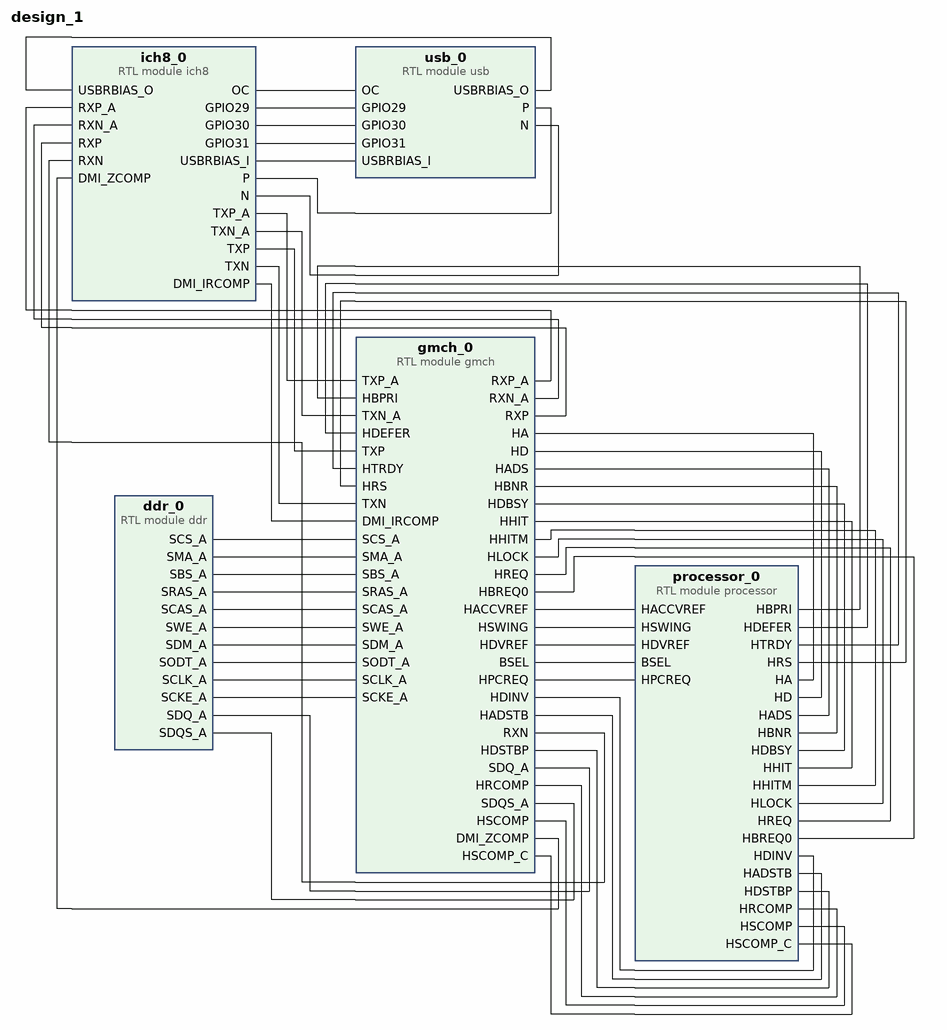
[diagram p0: block diagram of the top level]
# Vivado block design design_1, xc7a100tcsg324-1, Vivado 2019.2
create_bd_design design_1

create_bd_cell -type module -reference usb usb_0
create_bd_cell -type module -reference ich8 ich8_0
create_bd_cell -type module -reference ddr ddr_0
create_bd_cell -type module -reference gmch gmch_0
create_bd_cell -type module -reference processor processor_0

# ---- connections ----

connect_bd_net [get_bd_pins processor_0/HA] [get_bd_pins gmch_0/HA]
connect_bd_net [get_bd_pins gmch_0/HD] [get_bd_pins processor_0/HD]
connect_bd_net [get_bd_pins gmch_0/HADS] [get_bd_pins processor_0/HADS]
connect_bd_net [get_bd_pins gmch_0/HBNR] [get_bd_pins processor_0/HBNR]
connect_bd_net [get_bd_pins gmch_0/HDBSY] [get_bd_pins processor_0/HDBSY]
connect_bd_net [get_bd_pins gmch_0/HHIT] [get_bd_pins processor_0/HHIT]
connect_bd_net [get_bd_pins processor_0/HBPRI] [get_bd_pins gmch_0/HBPRI]
connect_bd_net [get_bd_pins processor_0/HDEFER] [get_bd_pins gmch_0/HDEFER]
connect_bd_net [get_bd_pins gmch_0/HHITM] [get_bd_pins processor_0/HHITM]
connect_bd_net [get_bd_pins gmch_0/HLOCK] [get_bd_pins processor_0/HLOCK]
connect_bd_net [get_bd_pins gmch_0/HREQ] [get_bd_pins processor_0/HREQ]
connect_bd_net [get_bd_pins processor_0/HTRDY] [get_bd_pins gmch_0/HTRDY]
connect_bd_net [get_bd_pins processor_0/HRS] [get_bd_pins gmch_0/HRS]
connect_bd_net [get_bd_pins gmch_0/HBREQ0] [get_bd_pins processor_0/HBREQ0]
connect_bd_net [get_bd_pins gmch_0/HDINV] [get_bd_pins processor_0/HDINV]
connect_bd_net [get_bd_pins gmch_0/HADSTB] [get_bd_pins processor_0/HADSTB]
connect_bd_net [get_bd_pins gmch_0/HDSTBP] [get_bd_pins processor_0/HDSTBP]
connect_bd_net [get_bd_pins gmch_0/HRCOMP] [get_bd_pins processor_0/HRCOMP]
connect_bd_net [get_bd_pins gmch_0/HSCOMP] [get_bd_pins processor_0/HSCOMP]
connect_bd_net [get_bd_pins gmch_0/HSCOMP_C] [get_bd_pins processor_0/HSCOMP_C]
connect_bd_net [get_bd_pins gmch_0/HACCVREF] [get_bd_pins processor_0/HACCVREF]
connect_bd_net [get_bd_pins gmch_0/HSWING] [get_bd_pins processor_0/HSWING]
connect_bd_net [get_bd_pins gmch_0/HDVREF] [get_bd_pins processor_0/HDVREF]
connect_bd_net [get_bd_pins gmch_0/BSEL] [get_bd_pins processor_0/BSEL]
connect_bd_net [get_bd_pins gmch_0/HPCREQ] [get_bd_pins processor_0/HPCREQ]
connect_bd_net [get_bd_pins ich8_0/TXP_A] [get_bd_pins gmch_0/TXP_A]
connect_bd_net [get_bd_pins ich8_0/TXN_A] [get_bd_pins gmch_0/TXN_A]
connect_bd_net [get_bd_pins ich8_0/TXP] [get_bd_pins gmch_0/TXP]
connect_bd_net [get_bd_pins ich8_0/TXN] [get_bd_pins gmch_0/TXN]
connect_bd_net [get_bd_pins ich8_0/DMI_IRCOMP] [get_bd_pins gmch_0/DMI_IRCOMP]
connect_bd_net [get_bd_pins ich8_0/OC] [get_bd_pins usb_0/OC]
connect_bd_net [get_bd_pins ich8_0/GPIO29] [get_bd_pins usb_0/GPIO29]
connect_bd_net [get_bd_pins ich8_0/GPIO30] [get_bd_pins usb_0/GPIO30]
connect_bd_net [get_bd_pins ich8_0/GPIO31] [get_bd_pins usb_0/GPIO31]
connect_bd_net [get_bd_pins ich8_0/USBRBIAS_I] [get_bd_pins usb_0/USBRBIAS_I]
connect_bd_net [get_bd_pins ich8_0/P] [get_bd_pins usb_0/P]
connect_bd_net [get_bd_pins ich8_0/N] [get_bd_pins usb_0/N]
connect_bd_net [get_bd_pins usb_0/USBRBIAS_O] [get_bd_pins ich8_0/USBRBIAS_O]
connect_bd_net [get_bd_pins gmch_0/RXP_A] [get_bd_pins ich8_0/RXP_A]
connect_bd_net [get_bd_pins gmch_0/RXN_A] [get_bd_pins ich8_0/RXN_A]
connect_bd_net [get_bd_pins gmch_0/RXP] [get_bd_pins ich8_0/RXP]
connect_bd_net [get_bd_pins gmch_0/RXN] [get_bd_pins ich8_0/RXN]
connect_bd_net [get_bd_pins gmch_0/DMI_ZCOMP] [get_bd_pins ich8_0/DMI_ZCOMP]
connect_bd_net [get_bd_pins ddr_0/SCS_A] [get_bd_pins gmch_0/SCS_A]
connect_bd_net [get_bd_pins ddr_0/SMA_A] [get_bd_pins gmch_0/SMA_A]
connect_bd_net [get_bd_pins ddr_0/SBS_A] [get_bd_pins gmch_0/SBS_A]
connect_bd_net [get_bd_pins ddr_0/SRAS_A] [get_bd_pins gmch_0/SRAS_A]
connect_bd_net [get_bd_pins ddr_0/SCAS_A] [get_bd_pins gmch_0/SCAS_A]
connect_bd_net [get_bd_pins ddr_0/SWE_A] [get_bd_pins gmch_0/SWE_A]
connect_bd_net [get_bd_pins ddr_0/SDM_A] [get_bd_pins gmch_0/SDM_A]
connect_bd_net [get_bd_pins ddr_0/SODT_A] [get_bd_pins gmch_0/SODT_A]
connect_bd_net [get_bd_pins ddr_0/SCLK_A] [get_bd_pins gmch_0/SCLK_A]
connect_bd_net [get_bd_pins ddr_0/SCKE_A] [get_bd_pins gmch_0/SCKE_A]
connect_bd_net [get_bd_pins gmch_0/SDQ_A] [get_bd_pins ddr_0/SDQ_A]
connect_bd_net [get_bd_pins ddr_0/SDQS_A] [get_bd_pins gmch_0/SDQS_A]

validate_bd_design
save_bd_design
